# EasyEDA Pro project USB_C_BREADBOARD_PD.eprj, schematic Schematic1
Board Name: Board1; Create Date: 2025-01-16; Page Name: P1; Project Name: USB_C_BREADBOARD_PD; Schematic Name: Schematic1; Update Date: 2025-01-19; Company: EasyEDA.com; Page Size: A4; Version: V1.0
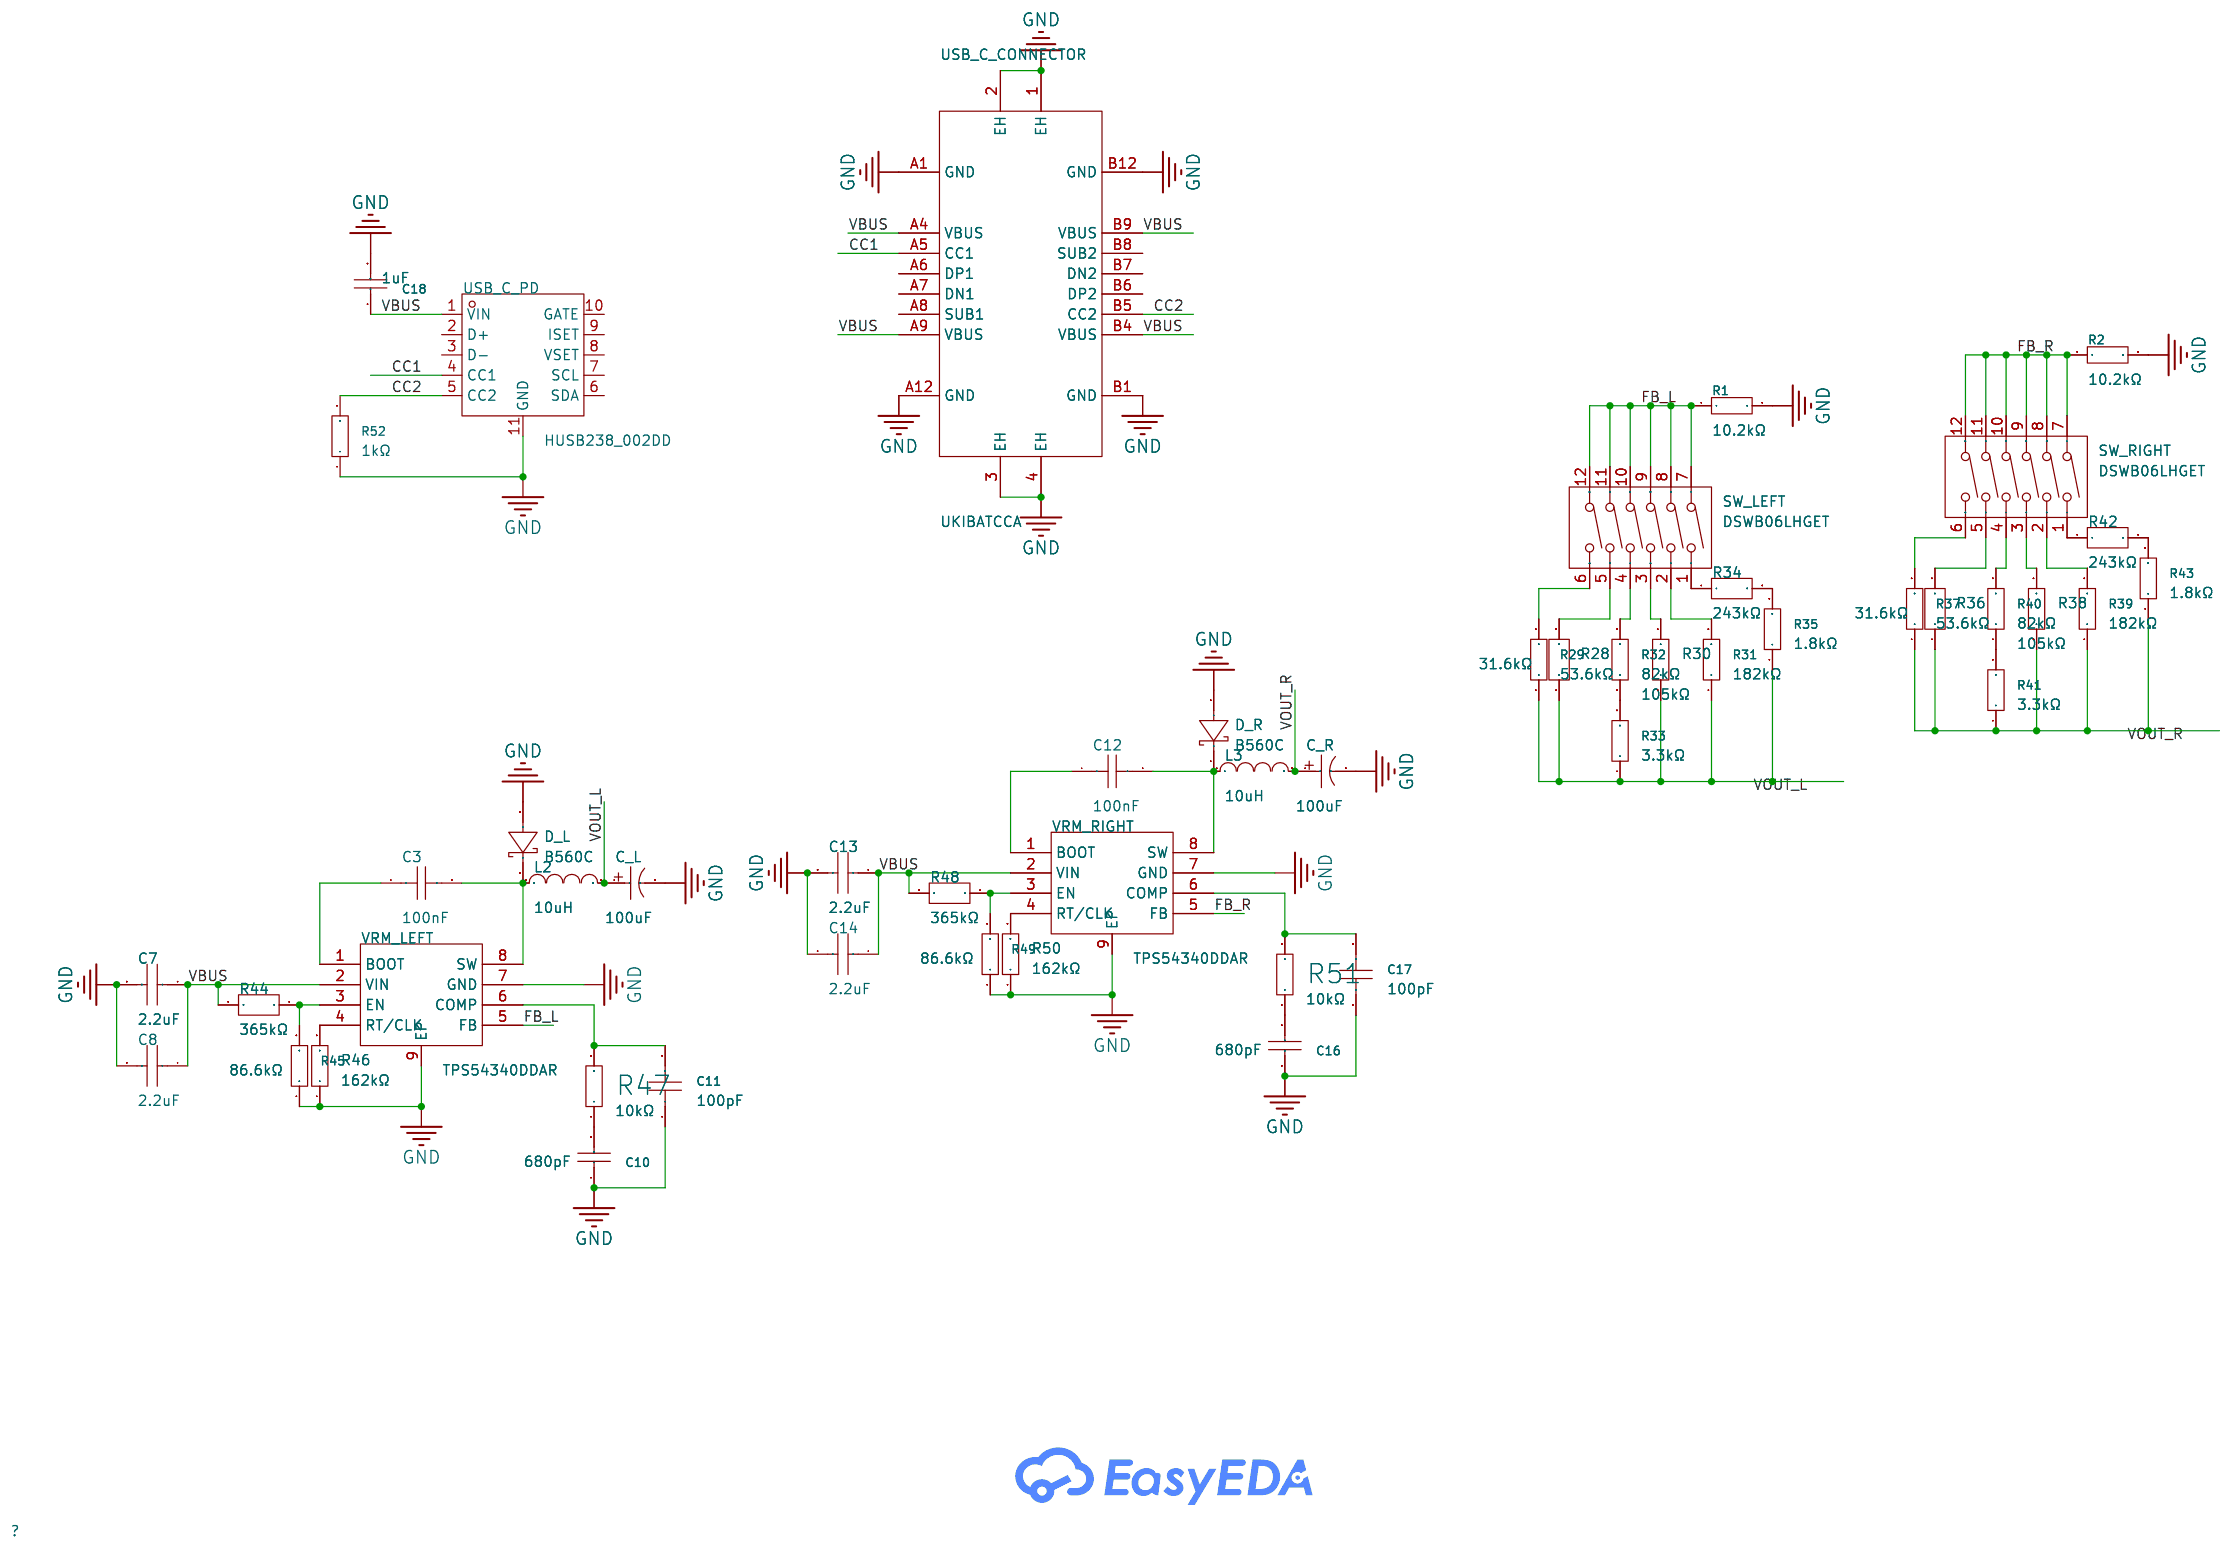
[diagram p0: schematic sheet]

## Parts
C3  100nF  [C0603]
C7  2.2uF  [C0402]
C8  2.2uF  [C0402]
C10  680pF  [C0603]
C11  100pF  [C0603]
C12  100nF  [C0603]
C13  2.2uF  [C0402]
C14  2.2uF  [C0402]
C16  680pF  [C0603]
C17  100pF  [C0603]
C18  1uF  [C0402]
C_L  100uF  [CAP-SMD_BD6.3-L6.6-W6.6-LS7.6-FD]
C_R  100uF  [CAP-SMD_BD6.3-L6.6-W6.6-LS7.6-FD]
D_L  B560C  [SMC_L6.9-W5.9-LS7.9-RD]
D_R  B560C  [SMC_L6.9-W5.9-LS7.9-RD]
L2  10uH  [IND-SMD_L7.3-W6.8]
L3  10uH  [IND-SMD_L7.3-W6.8]
R1  10.2kΩ  [R0402]
R2  10.2kΩ  [R0402]
R28  53.6kΩ  [R0603]
R29  31.6kΩ  [R0603]
R30  105kΩ  [R0603]
R31  182kΩ  [R0603]
R32  82kΩ  [R0603]
R33  3.3kΩ  [R0603]
R34  243kΩ  [R0603]
R35  1.8kΩ  [R0603]
R36  53.6kΩ  [R0603]
R37  31.6kΩ  [R0603]
R38  105kΩ  [R0603]
R39  182kΩ  [R0603]
R40  82kΩ  [R0603]
R41  3.3kΩ  [R0603]
R42  243kΩ  [R0603]
R43  1.8kΩ  [R0603]
R44  365kΩ  [R0603]
R45  86.6kΩ  [R0603]
R46  162kΩ  [R0603]
R47  10kΩ  [R0603]
R48  365kΩ  [R0603]
R49  86.6kΩ  [R0603]
R50  162kΩ  [R0603]
R51  10kΩ  [R0603]
R52  1kΩ  [R0402]
SW_LEFT  DSWB06LHGET  [SW-TH_DSWB06LHGET]
SW_RIGHT  DSWB06LHGET  [SW-TH_DSWB06LHGET]
USB_C_CONNECTOR  UKIBATCCA  [USB-C-SMD_UKIBATCCA]
USB_C_PD  HUSB238_002DD  [DFN-10_L3.0-W3.0-P0.50-BL-EP2.5]
VRM_LEFT  TPS54340DDAR  [SOIC-8_L4.9-W3.9-P1.27-LS6.0-BL-EP3.3]
VRM_RIGHT  TPS54340DDAR  [SOIC-8_L4.9-W3.9-P1.27-LS6.0-BL-EP3.3]

## Library data of the parts
C3 C12 = CGA0603X7R104K500JT: LCSC Part Name: 100nF ±10% 50V; Supplier Part: C6119867; Manufacturer: HRE(芯声); Supplier Footprint: 0603; JLCPCB Part Class: Extended Part; Supplier: LCSC; Tolerance: ±10%; Voltage Rated: 50V
C7 C8 C13 C14 = CL05A225MQ5NSNC: LCSC Part Name: 2.2uF ±20% 6.3V; Supplier Part: C12530; Manufacturer: SAMSUNG(三星); Supplier Footprint: 0402; JLCPCB Part Class: Basic Part; Datasheet: https://atta.szlcsc.com/upload/public/pdf/source/20160218/1457707763339.pdf; Supplier: LCSC; Tolerance: ±20%
C10 C16 = CC0603JRNPO9BN681: LCSC Part Name: 680pF ±5% 50V; Supplier Part: C107055; Manufacturer: YAGEO(国巨); Supplier Footprint: 0603; JLCPCB Part Class: Extended Part; Datasheet: https://atta.szlcsc.com/upload/public/pdf/source/20170914/C128857_1505359892143968080.pdf; Supplier: LCSC; Tolerance: ±5%
C11 C17 = CC0603JRNPO9BN101: LCSC Part Name: 100pF ±5% 50V; Supplier Part: C14665; Manufacturer: YAGEO(国巨); Supplier Footprint: 0603; JLCPCB Part Class: Extended Part; Datasheet: https://atta.szlcsc.com/upload/public/pdf/source/20181008/C309499_21CC21451B82C39E3D92150FD6B30293.pdf; Supplier: LCSC; Tolerance: ±5%
C18 = CL05A105KO5NNNC: LCSC Part Name: 1uF ±10% 16V; Supplier Part: C29266; Manufacturer: SAMSUNG(三星); Supplier Footprint: 0402; JLCPCB Part Class: Extended Part; Datasheet: https://atta.szlcsc.com/upload/public/pdf/source/20160218/1457707763339.pdf; Supplier: LCSC; Tolerance: ±10%
C_L C_R = RVT1V101M0607_C72478: LCSC Part Name: 100uF ±20% 35V; Supplier Part: C72478; Manufacturer: ROQANG(容强); Manufacturer Part: RVT1V101M0607; Supplier Footprint: SMD,D6.3xL7.7mm; JLCPCB Part Class: Extended Part; Datasheet: https://atta.szlcsc.com/upload/public/pdf/source/20170325/1490427950282.pdf; Supplier: LCSC; Tolerance: ±20%; Ripple Current: 69mA@120Hz; Lifetime @ Temp: 2000hrs@105℃; Operating Temperature: -40℃~+105℃
D_L D_R = B560C_C6807784: LCSC Part Name: 电压:60V 电流:5A; Supplier Part: C6807784; Manufacturer: FUXINSEMI(富芯森美); Supplier Footprint: SMC(DO-214AB); JLCPCB Part Class: Extended Part; Datasheet: https://atta.szlcsc.com/upload/public/pdf/source/20230727/BBD047E09E3983A1DBEAE079A1E2DA84.pdf; Supplier: LCSC; Diode Configuration: Independent Type; Forward Voltage (Vf@If): 700mV@5A; Reverse Voltage (Vr): 60V; Rectified Current: 5A; Reverse Leakage Current (Ir): 100uA@60V
L2 L3 = FXL0630-100-M: LCSC Part Name: 10uH ±20% 5.5A; Supplier Part: C167223; Manufacturer: cjiang(长江微电); Supplier Footprint: SMD,6.6x7mm; JLCPCB Part Class: Extended Part; Datasheet: https://atta.szlcsc.com/upload/public/pdf/source/20240426/3189EA8206330E2108542F9E34E540E7.pdf; Supplier: LCSC; Tolerance: ±20%; Saturation Current (Isat): 5.5A; Type: Integrated molded inductor
R1 R2 = 0402WGF1022TCE: LCSC Part Name: 10.2kΩ ±1% 62.5mW 厚膜电阻; Supplier Part: C11660; Manufacturer: UNI-ROYAL(厚声); Supplier Footprint: 0402; JLCPCB Part Class: Extended Part; Datasheet: https://atta.szlcsc.com/upload/public/pdf/source/20200306/C422600_1E6D84923E4A46A82E41ADD87F860B5C.pdf; Supplier: LCSC; Type: Thick Film Resistors; Tolerance: ±1%; Temperature Coefficient: ±100ppm/℃; Operating Temperature Range: -55℃~+155℃
R28 R36 = FRC0603F5362TS: LCSC Part Name: 53.6kΩ ±1% 100mW 厚膜电阻; Supplier Part: C2930115; Manufacturer: FOJAN(富捷); Supplier Footprint: 0603; JLCPCB Part Class: Extended Part; Datasheet: https://atta.szlcsc.com/upload/public/pdf/source/20211221/925EC7D7225764EE0046F22065062C87.pdf; Supplier: LCSC; Type: Thick Film Resistors; Tolerance: ±1%; Temperature Coefficient: ±100ppm/℃; Operating Temperature Range: -55℃~+155℃
R29 R37 = 0603WAF3162T5E: LCSC Part Name: 31.6kΩ ±1% 100mW 厚膜电阻; Supplier Part: C25967; Manufacturer: UNI-ROYAL(厚声); Supplier Footprint: 0603; JLCPCB Part Class: Extended Part; Datasheet: https://atta.szlcsc.com/upload/public/pdf/source/20200306/C422600_1E6D84923E4A46A82E41ADD87F860B5C.pdf; Supplier: LCSC; Type: Thick Film Resistors; Tolerance: ±1%; Temperature Coefficient: ±100ppm/℃; Operating Temperature Range: -55℃~+155℃
R30 R38 = 0603WAF1053T5E: LCSC Part Name: 105kΩ ±1% 100mW 厚膜电阻; Supplier Part: C16840; Manufacturer: UNI-ROYAL(厚声); Supplier Footprint: 0603; JLCPCB Part Class: Extended Part; Datasheet: https://atta.szlcsc.com/upload/public/pdf/source/20200306/C422600_1E6D84923E4A46A82E41ADD87F860B5C.pdf; Supplier: LCSC; Type: Thick Film Resistors; Tolerance: ±1%; Temperature Coefficient: ±100ppm/℃; Operating Temperature Range: -55℃~+155℃
R31 R39 = 0603WAF1823T5E: LCSC Part Name: 182kΩ ±1% 100mW 厚膜电阻; Supplier Part: C22894; Manufacturer: UNI-ROYAL(厚声); Supplier Footprint: 0603; JLCPCB Part Class: Extended Part; Datasheet: https://atta.szlcsc.com/upload/public/pdf/source/20200306/C422600_1E6D84923E4A46A82E41ADD87F860B5C.pdf; Supplier: LCSC; Type: Thick Film Resistors; Tolerance: ±1%; Temperature Coefficient: ±100ppm/℃; Operating Temperature Range: -55℃~+155℃
R32 R40 = 0603WAF8202T5E: LCSC Part Name: 82kΩ ±1% 100mW 厚膜电阻; Supplier Part: C23254; Manufacturer: UNI-ROYAL(厚声); Supplier Footprint: 0603; JLCPCB Part Class: Basic Part; Datasheet: https://atta.szlcsc.com/upload/public/pdf/source/20200306/C422600_1E6D84923E4A46A82E41ADD87F860B5C.pdf; Supplier: LCSC; Type: Thick Film Resistors; Tolerance: ±1%; Temperature Coefficient: ±100ppm/℃; Operating Temperature Range: -55℃~+155℃
R33 R41 = 0603WAF3301T5E: LCSC Part Name: 3.3kΩ ±1% 100mW 厚膜电阻; Supplier Part: C22978; Manufacturer: UNI-ROYAL(厚声); Supplier Footprint: 0603; JLCPCB Part Class: Basic Part; Datasheet: https://atta.szlcsc.com/upload/public/pdf/source/20200306/C422600_1E6D84923E4A46A82E41ADD87F860B5C.pdf; Supplier: LCSC; Type: Thick Film Resistors; Tolerance: ±1%; Temperature Coefficient: ±100ppm/℃; Operating Temperature Range: -55℃~+155℃
R34 R42 = FRC0603F2433TS: LCSC Part Name: 厚膜电阻 243kΩ ±1% 100mW; Supplier Part: C7467321; Manufacturer: FOJAN(富捷); Supplier Footprint: 0603; JLCPCB Part Class: Extended Part; Datasheet: https://atta.szlcsc.com/upload/public/pdf/source/20211221/9022FBEBBD509006A57EBC43C1F2F40C.pdf; Supplier: LCSC; Type: Thick Film Resistors; Tolerance: ±1%; Temperature Coefficient: ±100ppm/℃
R35 R43 = 0603WAF1801T5E: LCSC Part Name: 1.8kΩ ±1% 100mW 厚膜电阻; Supplier Part: C4177; Manufacturer: UNI-ROYAL(厚声); Supplier Footprint: 0603; JLCPCB Part Class: Basic Part; Datasheet: https://atta.szlcsc.com/upload/public/pdf/source/20200306/C422600_1E6D84923E4A46A82E41ADD87F860B5C.pdf; Supplier: LCSC; Type: Thick Film Resistors; Tolerance: ±1%; Temperature Coefficient: ±100ppm/℃; Operating Temperature Range: -55℃~+155℃
R44 R48 = FRC0603F3653TS: LCSC Part Name: 厚膜电阻 365kΩ 100mW ±1%; Supplier Part: C19267399; Manufacturer: FOJAN(富捷); Supplier Footprint: 0603; JLCPCB Part Class: Extended Part; Datasheet: https://atta.szlcsc.com/upload/public/pdf/source/20230825/D7BB05C431FE4193B31D29C3AB35173D.pdf; Supplier: LCSC; Type: Thick Film Resistors; Tolerance: ±1%; Temperature Coefficient: ±100ppm/℃
R45 R49 = 0603WAF8662T5E: LCSC Part Name: 86.6kΩ ±1% 100mW 厚膜电阻; Supplier Part: C23121; Manufacturer: UNI-ROYAL(厚声); Supplier Footprint: 0603; JLCPCB Part Class: Extended Part; Datasheet: https://atta.szlcsc.com/upload/public/pdf/source/20200306/C422600_1E6D84923E4A46A82E41ADD87F860B5C.pdf; Supplier: LCSC; Type: Thick Film Resistors; Tolerance: ±1%; Temperature Coefficient: ±100ppm/℃; Operating Temperature Range: -55℃~+155℃
R46 R50 = 0603WAF1623T5E: LCSC Part Name: 162kΩ ±1% 100mW 厚膜电阻; Supplier Part: C22815; Manufacturer: UNI-ROYAL(厚声); Supplier Footprint: 0603; JLCPCB Part Class: Extended Part; Datasheet: https://atta.szlcsc.com/upload/public/pdf/source/20200306/C422600_1E6D84923E4A46A82E41ADD87F860B5C.pdf; Supplier: LCSC; Type: Thick Film Resistors; Tolerance: ±1%; Temperature Coefficient: ±100ppm/℃; Operating Temperature Range: -55℃~+155℃
R47 R51 = 0603WAF1002T5E: LCSC Part Name: 厚膜电阻 10kΩ ±1% 100mW; Supplier Part: C25804; Manufacturer: UNI-ROYAL(厚声); Supplier Footprint: 0603; JLCPCB Part Class: Basic Part; Datasheet: https://atta.szlcsc.com/upload/public/pdf/source/20200306/C422600_1E6D84923E4A46A82E41ADD87F860B5C.pdf; Supplier: LCSC; Type: Thick Film Resistors; Tolerance: ±1%; Temperature Coefficient: ±100ppm/℃; Operating Temperature Range: -55℃~+155℃
R52 = 0402WGF1001TCE: LCSC Part Name: 1kΩ ±1% 62.5mW 厚膜电阻; Supplier Part: C11702; Manufacturer: UNI-ROYAL(厚声); Supplier Footprint: 0402; JLCPCB Part Class: Basic Part; Datasheet: https://atta.szlcsc.com/upload/public/pdf/source/20200306/C422600_1E6D84923E4A46A82E41ADD87F860B5C.pdf; Supplier: LCSC; Type: Thick Film Resistors; Tolerance: ±1%; Temperature Coefficient: ±100ppm/℃; Operating Temperature Range: -55℃~+155℃
SW_LEFT SW_RIGHT = DSWB06LHGET: LCSC Part Name: 拨码开关,平拨开关,DSWB06LHGET; Supplier Part: C99416; Manufacturer: YE; Supplier Footprint: 插件; JLCPCB Part Class: Extended Part; Datasheet: https://atta.szlcsc.com/upload/public/pdf/source/20170330/1490855795233.pdf; Supplier: LCSC; Type: 平拨,凸起式; Circuit: SPST; Number of Positions: 6Bit; Lead Pitch: 2.54mm; Color: Red
USB_C_CONNECTOR = UKIBATCCA: LCSC Part Name: Type-C 母 卧贴; Supplier Part: C29780877; Manufacturer: SAMZO(三佐); Supplier Footprint: SMD; JLCPCB Part Class: Extended Part; Datasheet: https://atta.szlcsc.com/upload/public/pdf/source/20240717/32BE29DCF56E1C8211E6A8D6AE117405.pdf; Supplier: LCSC; Connector Type: Type-C; Gender: Female; Mounting Style: Horizontal attachment; Number of Contacts: 16P; Number of Ports: 1; Current Rating - Power (Max): 5A; Rated Voltage (Max): 20V; Connect-Disconnect Life: 10,000 times; Length: 6.5mm; Core Colour: Black; Operating Temperature Range: -25℃~+85℃
USB_C_PD = HUSB238_002DD: Supplier Part: C7471904; Manufacturer: Hynetek(慧能泰); Supplier Footprint: DFN-10L(3x3); JLCPCB Part Class: Extended Part; Datasheet: https://atta.szlcsc.com/upload/public/pdf/source/20240407/14E2BCB22C39B22B34E48E1B6FC2FE3E.pdf; Supplier: LCSC
VRM_LEFT VRM_RIGHT = TPS54340DDAR: LCSC Part Name: 42V输入3.5A降压DC-DC转换器; Supplier Part: C45886; Manufacturer: TI(德州仪器); Supplier Footprint: SOIC-8-EP; JLCPCB Part Class: Extended Part; Datasheet: https://www.ti.com/cn/lit/gpn/tps54340; Supplier: LCSC; Function: Step-down type; Output Type: Adjustable; Input Voltage: 4.5V~42V; Output Voltage: 800mV~41.1V; Output Current: 3.5A; Switching Frequency: 2.5MHz; Operating Temperature: -40℃~+150℃@(TJ); Synchronous Rectification: No; Number of Outputs: 1; Topology: Step-down; Switch tube (built-in/external): Built-in

## Nets
GND: C7.2 C8.2 C10.1 C11.1 C13.2 C14.2 C16.1 C17.1 C18.2 C_L.2 C_R.2 D_L.2(A) D_R.2(A) R1.2 R2.2 R45.1 R46.1 R49.1 R50.1 R52.1 USB_C_CONNECTOR.1(EH) USB_C_CONNECTOR.2(EH) USB_C_CONNECTOR.3(EH) USB_C_CONNECTOR.4(EH) USB_C_CONNECTOR.A1(GND) USB_C_CONNECTOR.A12(GND) USB_C_CONNECTOR.B1(GND) USB_C_CONNECTOR.B12(GND) USB_C_PD.11(GND) VRM_LEFT.7(GND) VRM_LEFT.9(EP) VRM_RIGHT.7(GND) VRM_RIGHT.9(EP)
VBUS: C7.1 C8.1 C13.1 C14.1 C18.1 R44.2 R48.2 USB_C_CONNECTOR.A4(VBUS) USB_C_CONNECTOR.A9(VBUS) USB_C_CONNECTOR.B4(VBUS) USB_C_CONNECTOR.B9(VBUS) USB_C_PD.1(VIN) VRM_LEFT.2(VIN) VRM_RIGHT.2(VIN)
CC1: USB_C_CONNECTOR.A5(CC1) USB_C_PD.4(CC1)
CC2: R52.2 USB_C_CONNECTOR.B5(CC2) USB_C_PD.5(CC2)
FB_L: R1.1 SW_LEFT.7 SW_LEFT.8 SW_LEFT.9 SW_LEFT.10 SW_LEFT.11 SW_LEFT.12 VRM_LEFT.5(FB)
FB_R: R2.1 SW_RIGHT.7 SW_RIGHT.8 SW_RIGHT.9 SW_RIGHT.10 SW_RIGHT.11 SW_RIGHT.12 VRM_RIGHT.5(FB)
VOUT_L: C_L.1 L2.2 R28.1 R29.1 R30.1 R31.1 R33.1 R35.1
VOUT_R: C_R.1 L3.2 R36.1 R37.1 R38.1 R39.1 R41.1 R43.1
$1N5740: C3.1 VRM_LEFT.1(BOOT)
$1N5745: C3.2 D_L.1(K) L2.1 VRM_LEFT.8(SW)
$1N6296: R29.2 SW_LEFT.6
$1N6449: R28.2 SW_LEFT.5
$1N6649: R30.2 SW_LEFT.3
$1N6653: R31.2 SW_LEFT.2
$1N6699: R32.2 SW_LEFT.4
$1N6739: R32.1 R33.2
$1N6813: R34.1 SW_LEFT.1
$1N6887: R34.2 R35.2
$1N7317: R37.2 SW_RIGHT.6
$1N7320: R36.2 SW_RIGHT.5
$1N7323: R38.2 SW_RIGHT.3
$1N7326: R39.2 SW_RIGHT.2
$1N7329: R40.2 SW_RIGHT.4
$1N7332: R40.1 R41.2
$1N7334: R42.1 SW_RIGHT.1
$1N7336: R42.2 R43.2
$1N7988: R44.1 R45.2 VRM_LEFT.3(EN)
$1N8112: R46.2 VRM_LEFT.4(RT/CLK)
$1N8250: C11.2 R47.2 VRM_LEFT.6(COMP)
$1N8288: C10.2 R47.1
$1N9971: C12.1 VRM_RIGHT.1(BOOT)
$1N9972: C12.2 D_R.1(K) L3.1 VRM_RIGHT.8(SW)
$1N9979: R48.1 R49.2 VRM_RIGHT.3(EN)
$1N9980: R50.2 VRM_RIGHT.4(RT/CLK)
$1N9981: C17.2 R51.2 VRM_RIGHT.6(COMP)
$1N9982: C16.2 R51.1

Not connected (* = marked no-connect by the designer): USB_C_CONNECTOR A6(DP1) A7(DN1) A8(SUB1) B6(DP2) B7(DN2) B8(SUB2); USB_C_PD 2(D+) 3(D-) 6(SDA) 7(SCL) 8(VSET) 9(ISET) 10(GATE)
